# EAGLE board mainboard (EAGLE 9.6.2)
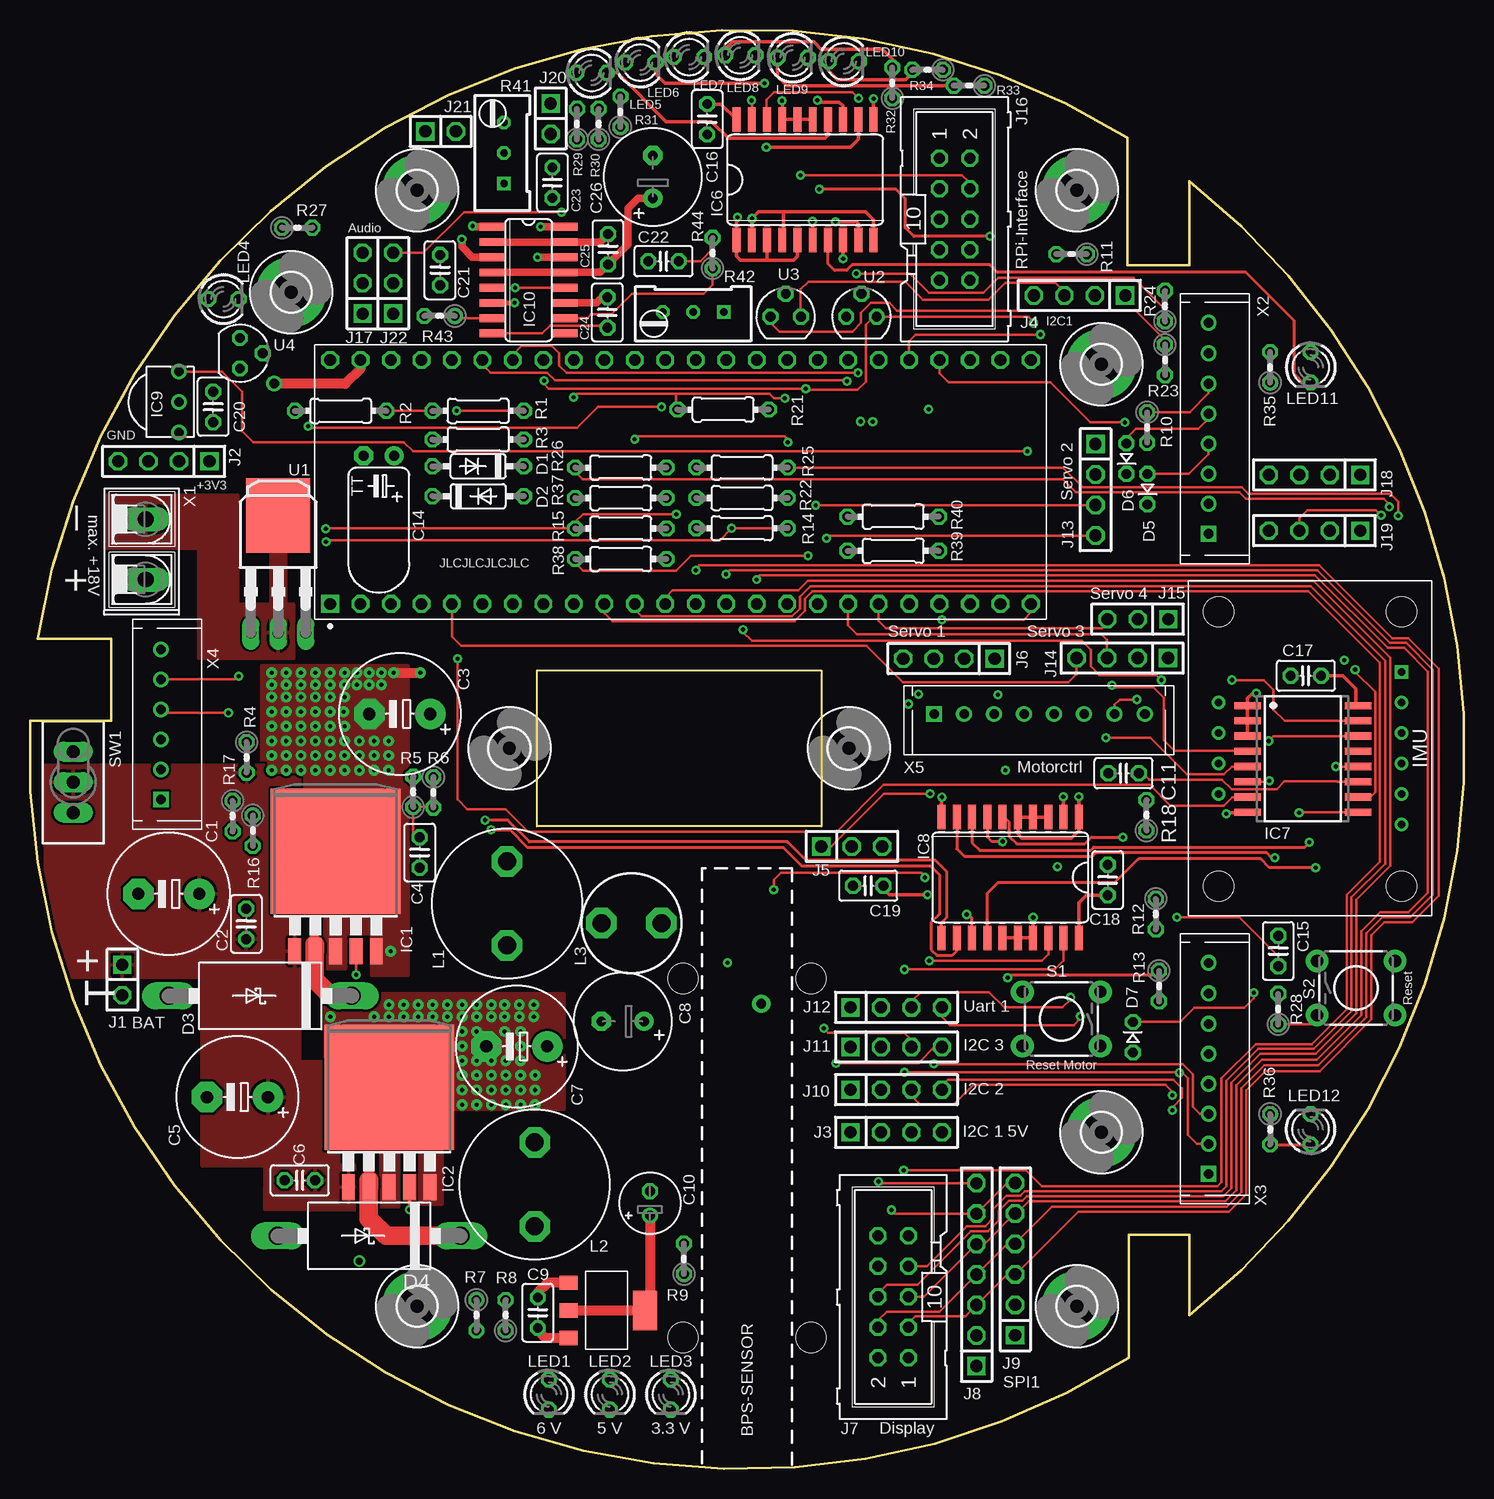
[diagram p2: board, top side]
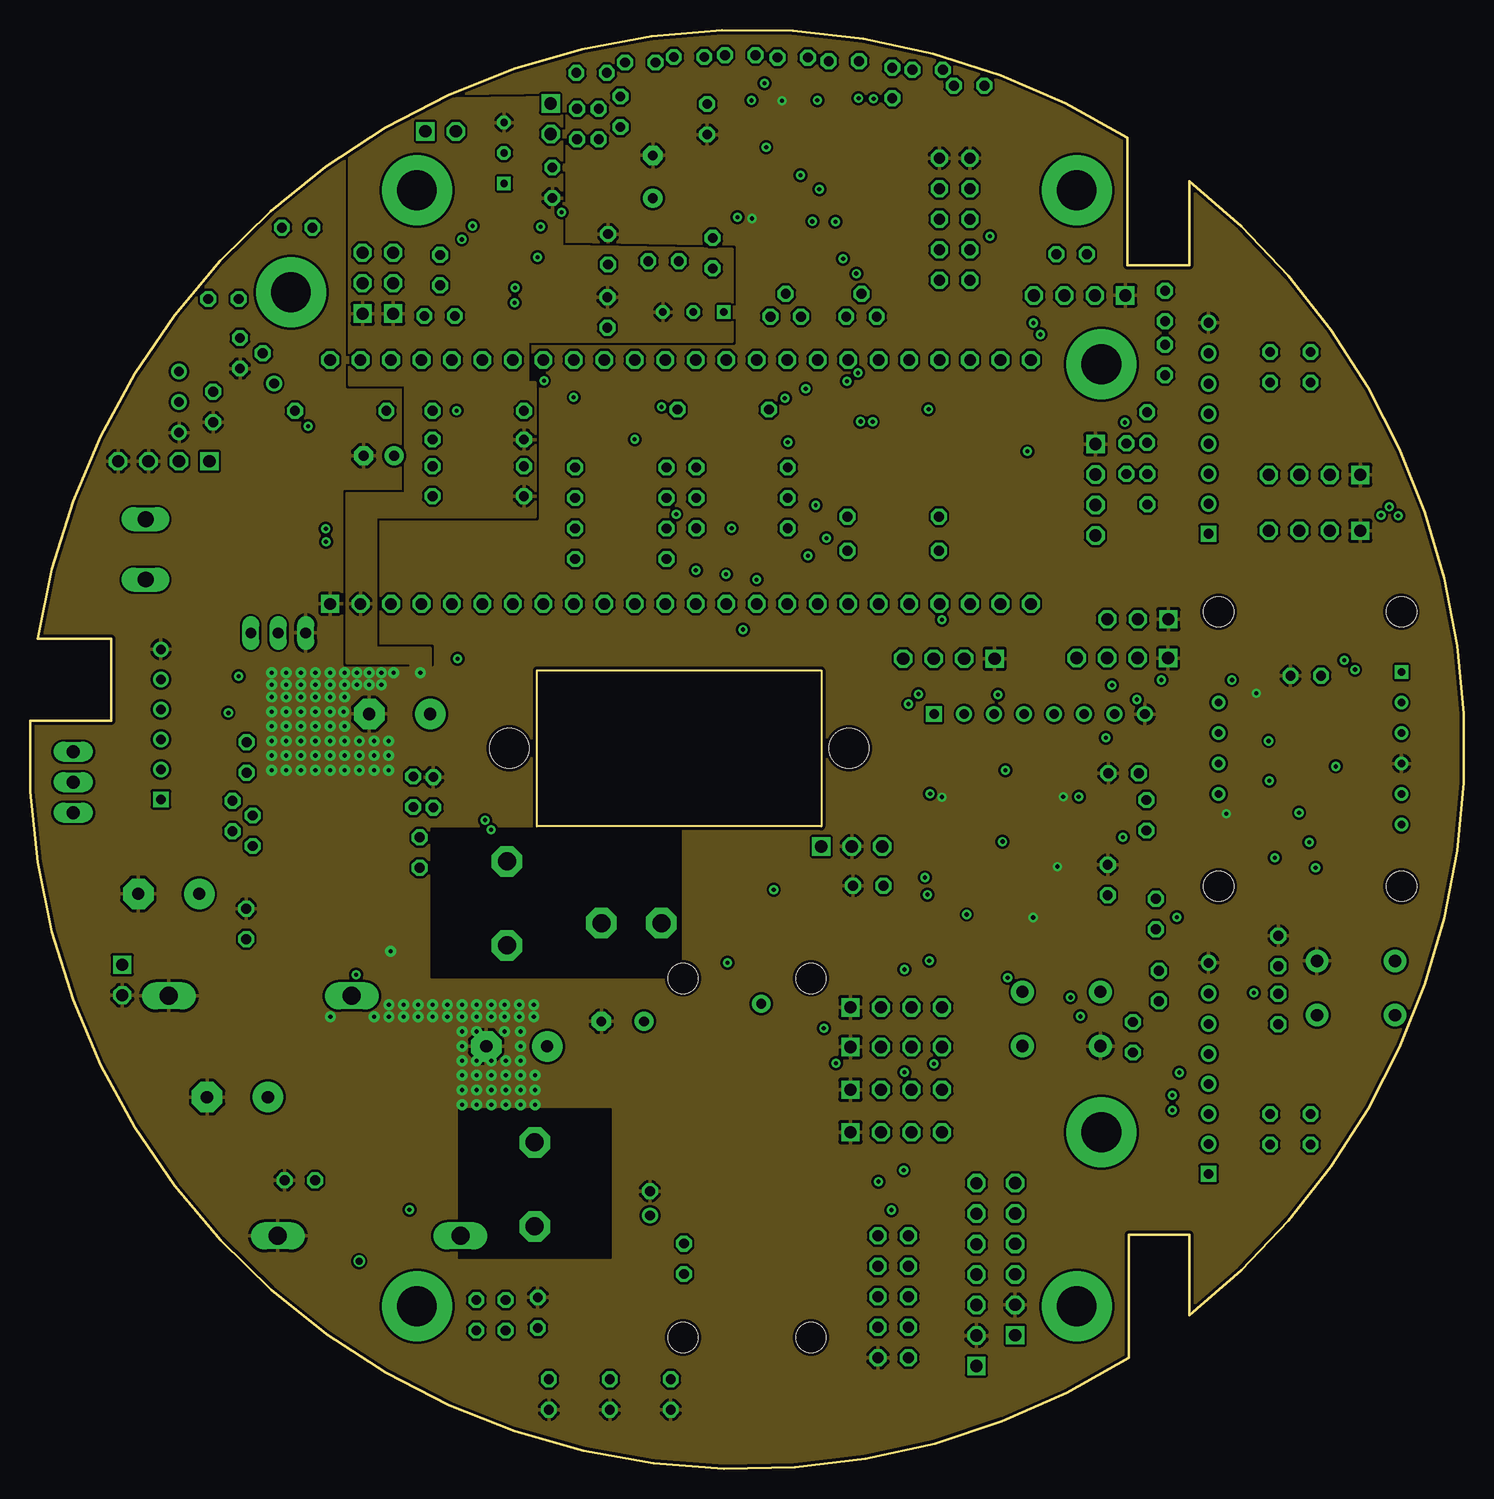
[diagram p3: board, inner layer GND]
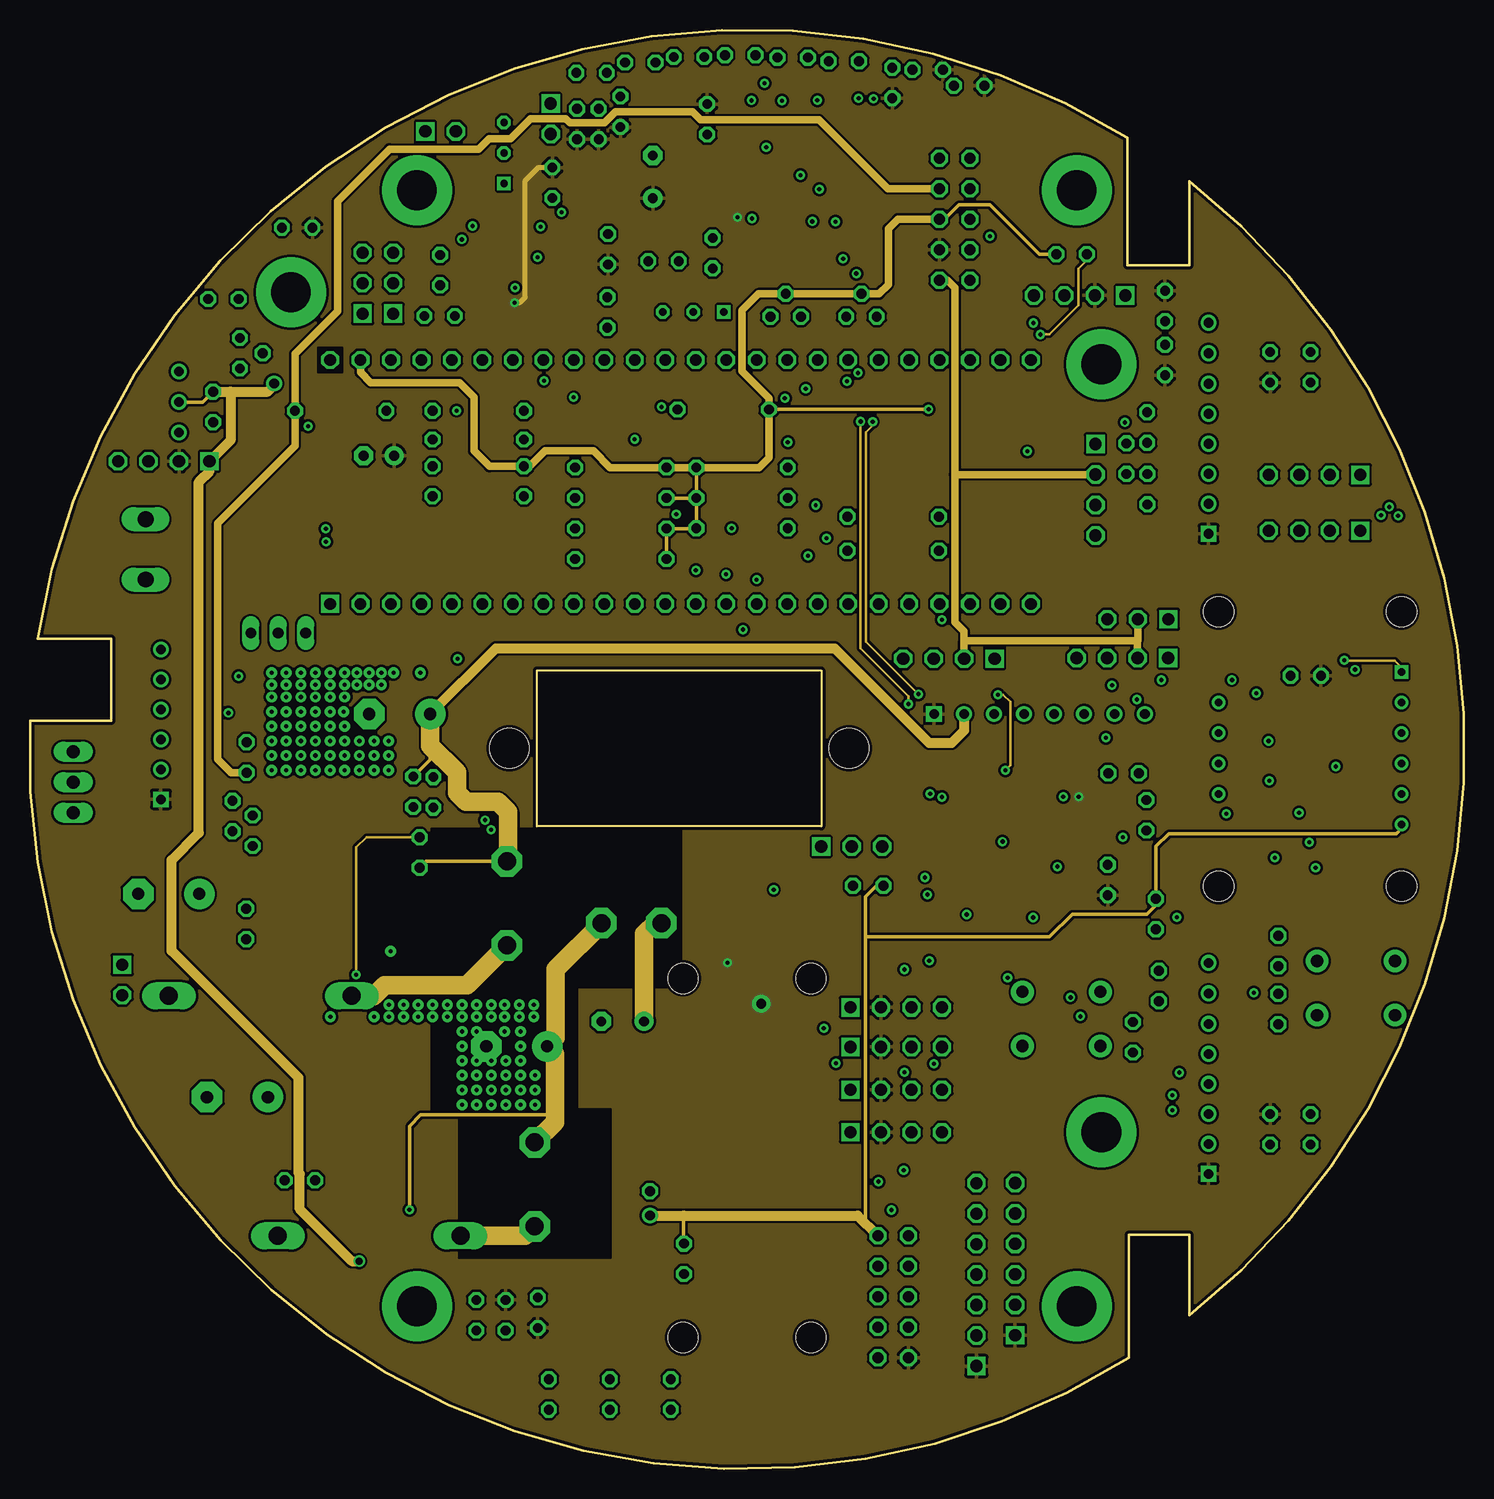
[diagram p4: board, inner layer Route15]
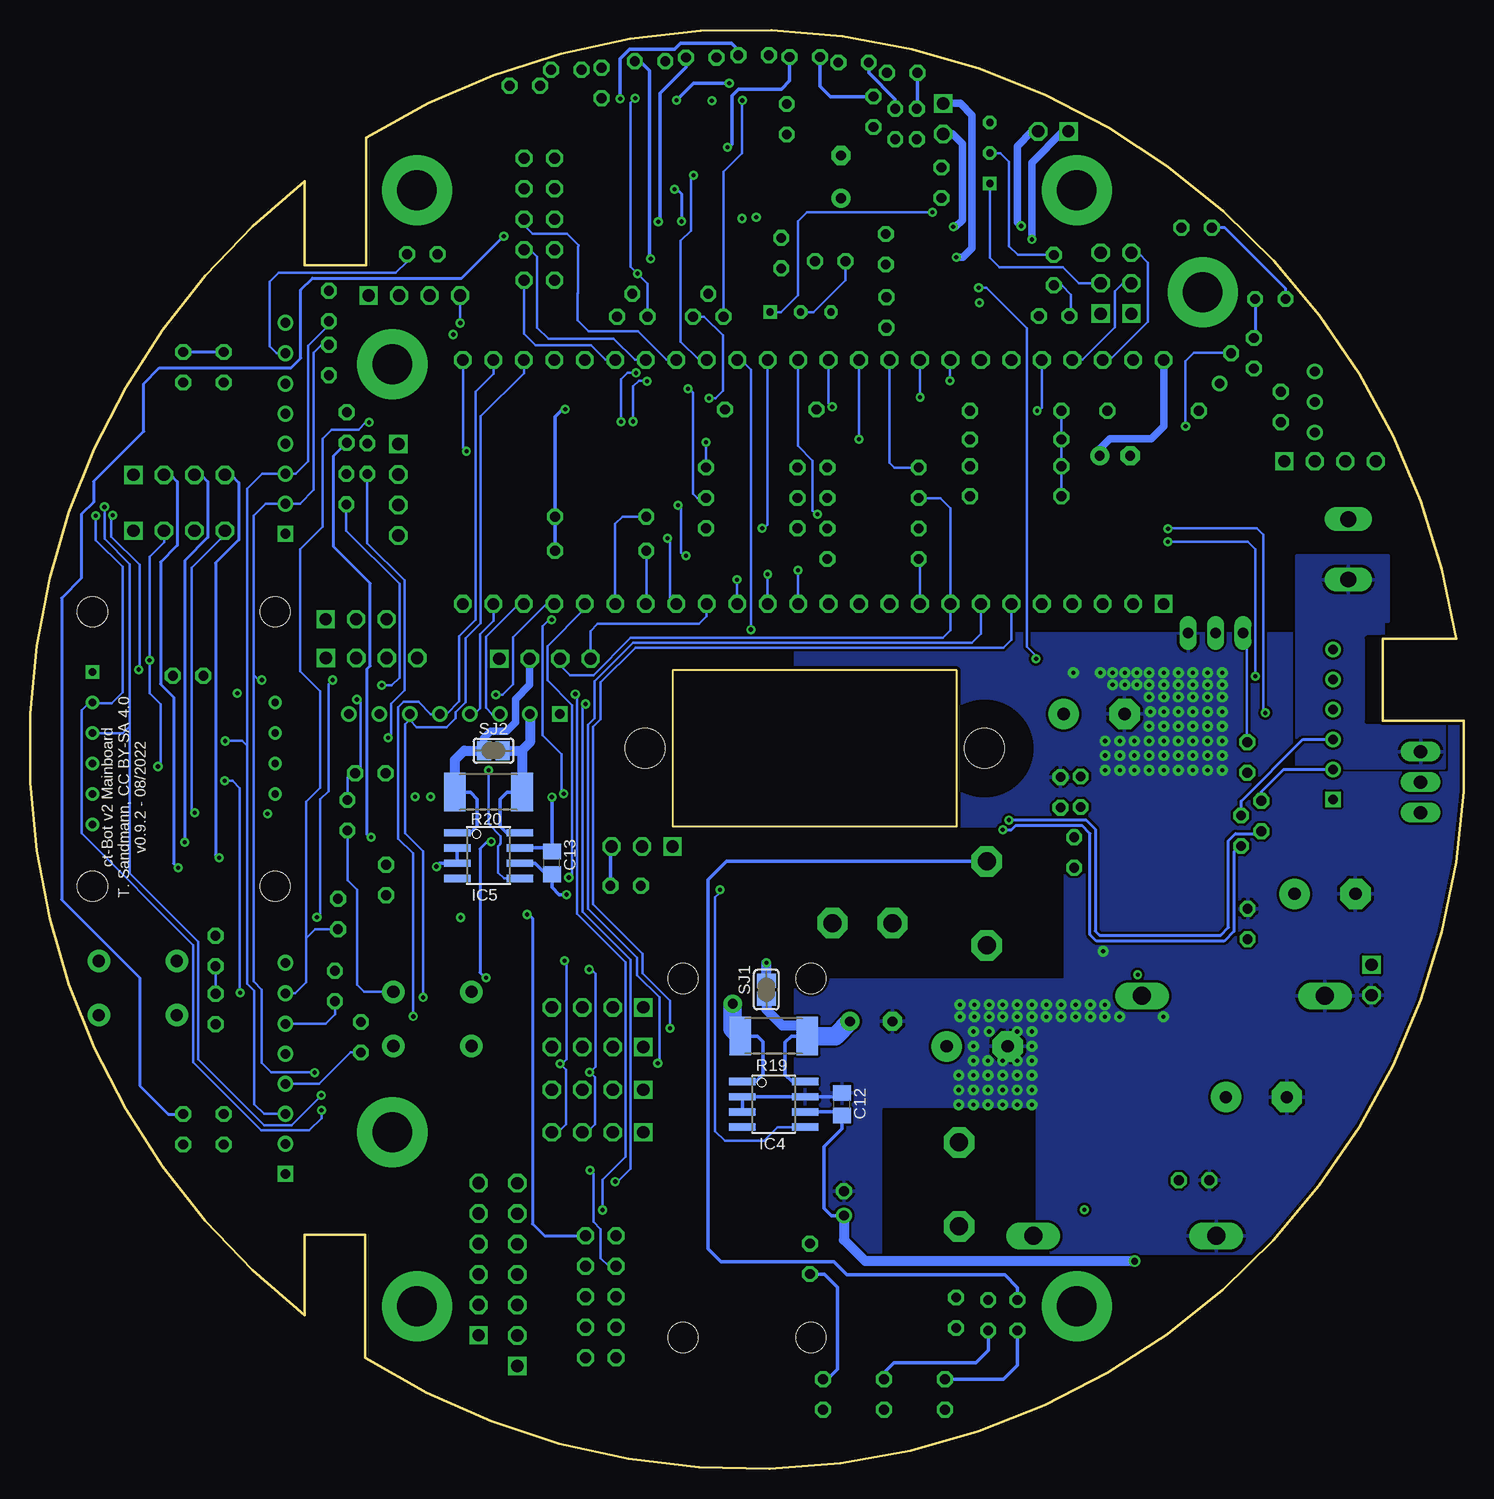
[diagram p5: board, bottom side, seen from below]

Size 119.53 x 119.9 mm. Coordinates in mm from the lower left corner, seen from the top.
Outline: 0.64,69.19 6.77,69.19 6.77,62.33 0,62.33 arc125 91.59,9.27 91.59,19.51 96.65,19.51 96.65,12.8 arc104 96.65,107.29 96.65,100.28 91.49,100.28 91.49,110.92 arc113 0.64,69.19
Outline: 42.27,66.55 65.97,66.55 65.97,53.55 42.27,53.55 42.27,66.55
Copper layers (1+2*15+16): Top 0.035mm / dielectric 0.2mm / GND 0.0175mm / dielectric 1.065mm / Route15 0.0175mm / dielectric 0.2mm / Bottom 0.035mm
Design rules "jlcpcb_4layer_DRU": minimum track width 6mil, minimum drill 0.3mm, track to track 6mil, track to pad 6mil, pad to pad 6mil, via to via 6mil, smd to smd 6mil, copper to edge 10mil, drill to drill 6mil, minimum pad ring 10mil, minimum via ring 8mil, stop-mask expansion 4mil, vias tented up to drill 0mil, thermal gap 10mil
Net classes: 0 default: width 0.203 mm, drill 0.33 mm, clearance 0.203 mm; 1 power: width 0.305 mm, drill 0.33 mm, clearance 0.203 mm to class 0, clearance 0.203 mm; 2 high_current: width 0.305 mm, drill 0.33 mm, clearance 0.203 mm to class 0, clearance 0.203 mm to class 1, clearance 0.203 mm
Holes 2.5 mm at 54.43,10.95 65.1,10.95 65.1,40.87 54.43,40.87
tRestrict: area 42.3,53.5 to 66,66.5; area 91.5,100.3 to 96.6,110.8; area 91.5,9.2 to 96.6,19.5; area 0.1,62.3 to 8.1,69.2
bRestrict: area 42.3,53.5 to 66,66.5; area 0.1,62.3 to 8.1,69.2; area 91.5,100.3 to 96.6,110.8; area 91.5,9.2 to 96.6,19.5
vRestrict: area 42.3,53.5 to 66,66.5; area 0.1,62.3 to 8.1,69.2; area 91.5,100.3 to 96.6,110.8; area 91.5,9.2 to 96.6,19.5

## Footprints (pad centres in the part's own frame; a part is rotated, then mirrored left to right if it is on the bottom)
E5-10,5 = drill 1.016 pad 2.54: + -2.54,0 | drill 1.016 pad 2.54 octagon: - 2.54,0
C025-025X050 = drill 0.813 octagon: 1 -1.27,0; 2 1.27,0
E3,5-8 = drill 0.813 pad 1.6: + -1.778,0 | drill 0.813 pad 1.6 octagon: - 1.778,0
E2-5 = drill 0.813 pad 1.27: + -1.016,0 | drill 0.813 pad 1.27 octagon: - 1.016,0
C0805 = smd 1.3 x 1.5: 1 -0.95,0; 2 0.95,0
TT2D5L = drill 0.813 pad 1.6: + -1.27,0 | drill 0.813 pad 1.6 octagon: - 1.27,0
DO35-7 = drill 0.813 octagon: A 3.81,0; C -3.81,0
DO201T15 = drill 1.499 long: A 7.62,0; C -7.62,0
0207/2V = drill 0.813 octagon: 1 -1.27,0; 2 1.27,0
TO263-5 = smd 1.067 x 2.159: 1 -3.404,-5.791; 2 -1.702,-5.791; 3 0,-5.791; 4 1.702,-5.791; 5 3.404,-5.791 | smd 10.8 x 10.41: 6 0,2.54
LD1117SOT-223 = smd 3.3 x 2: (VOUT) 0,3.2 | smd 1.2 x 1.5: GND -2.3,-3.2; VIN 2.3,-3.2; VOUT 0,-3.2
SO08 = smd 0.61 x 2.21: 1 -1.905,-2.616; 2 -0.635,-2.616; 3 0.635,-2.616; 4 1.905,-2.616; 5 1.905,2.616; 6 0.635,2.616; 7 -0.635,2.616; 8 -1.905,2.616
SO20W = smd 0.66 x 2.032: 1 -5.715,-5.029; 2 -4.445,-5.029; 3 -3.175,-5.029; 4 -1.905,-5.029; 5 -0.635,-5.029; 6 0.635,-5.029; 7 1.905,-5.029; 8 3.175,-5.029; 9 4.445,-5.029; 10 5.715,-5.029; 11 5.715,5.029; 12 4.445,5.029; 13 3.175,5.029; 14 1.905,5.029; 15 0.635,5.029; 16 -0.635,5.029; 17 -1.905,5.029; 18 -3.175,5.029; 19 -4.445,5.029; 20 -5.715,5.029
SO16W = smd 0.6 x 2.2: 1 -4.445,-4.6; 2 -3.175,-4.6; 3 -1.905,-4.6; 4 -0.635,-4.6; 5 0.635,-4.6; 6 1.905,-4.6; 7 3.175,-4.6; 8 4.445,-4.6; 9 4.445,4.6; 10 3.175,4.6; 11 1.905,4.6; 12 0.635,4.6; 13 -0.635,4.6; 14 -1.905,4.6; 15 -3.175,4.6; 16 -4.445,4.6
TSOP324 = drill 0.8: 1 -2.54,0; 2 0,0; 3 2.54,0
SOP-16 = smd 0.66 x 2.032: 1 -4.445,-3.073; 2 -3.175,-3.073; 3 -1.905,-3.073; 4 -0.635,-3.073; 5 0.635,-3.073; 6 1.905,-3.073; 7 3.175,-3.073; 8 4.445,-3.073; 9 4.445,3.073; 10 3.175,3.073; 11 1.905,3.073; 12 0.635,3.073; 13 -0.635,3.073; 14 -1.905,3.073; 15 -3.175,3.073; 16 -4.445,3.073
1X02 = drill 1.016 square: 1 -1.27,0 | drill 1.016 octagon: 2 1.27,0
1X04 = drill 1.016 square: 1 -3.81,0 | drill 1.016 octagon: 2 -1.27,0; 3 1.27,0; 4 3.81,0
1X03 = drill 1.016 square: 1 -2.54,0 | drill 1.016 octagon: 2 0,0; 3 2.54,0
ML10 = drill 0.914 octagon: 1 -5.08,-1.27; 2 -5.08,1.27; 3 -2.54,-1.27; 4 -2.54,1.27; 5 0,-1.27; 6 0,1.27; 7 2.54,-1.27; 8 2.54,1.27; 9 5.08,-1.27; 10 5.08,1.27
1X07 = drill 1.016 square: 1 -7.62,0 | drill 1.016 octagon: 2 -5.08,0; 3 -2.54,0; 4 0,0; 5 2.54,0; 6 5.08,0; 7 7.62,0
1X06 = drill 1.016 square: 1 -6.35,0 | drill 1.016 octagon: 2 -3.81,0; 3 -1.27,0; 4 1.27,0; 5 3.81,0; 6 6.35,0
09HCP = drill 1.5 pad 2.54 octagon: 1 0,3.5; 2 0,-3.5
FASTRON_07HCP_INDUCTOR = drill 1.5 pad 2.54 octagon: 1 -2.5,0; 2 2.5,0
LED3MM = drill 0.813 octagon: A -1.27,0; K 1.27,0
DIP48 = drill 0.965 square: 1 1.27,59.69 | drill 0.965 octagon: 2 1.27,57.15; 3 1.27,54.61; 4 1.27,52.07; 5 1.27,49.53; 6 1.27,46.99; 7 1.27,44.45; 8 1.27,41.91; 9 1.27,39.37; 10 1.27,36.83; 11 1.27,34.29; 12 1.27,31.75; 13 1.27,29.21; 14 1.27,26.67; 15 1.27,24.13; 16 1.27,21.59; 17 1.27,19.05; 18 1.27,16.51; 19 1.27,13.97; 20 1.27,11.43; 21 1.27,8.89; 22 1.27,6.35; 23 1.27,3.81; 24 1.27,1.27; 25 21.59,1.27; 26 21.59,3.81; 27 21.59,6.35; 28 21.59,8.89; 29 21.59,11.43; 30 21.59,13.97; 31 21.59,16.51; 32 21.59,19.05; 33 21.59,21.59; 34 21.59,24.13; 35 21.59,26.67; 36 21.59,29.21; 37 21.59,31.75; 38 21.59,34.29; 39 21.59,36.83; 40 21.59,39.37; 41 21.59,41.91; 42 21.59,44.45; 43 21.59,46.99; 44 21.59,49.53; 45 21.59,52.07; 46 21.59,54.61; 47 21.59,57.15; 48 21.59,59.69
0204/7 = drill 0.813 octagon: 1 -3.81,0; 2 3.81,0
0204V = drill 0.813 octagon: 1 -1.27,0; 2 1.27,0
R2512 = smd 1.8 x 3.2: 1 -2.8,0; 2 2.8,0
RTRIM64W = drill 0.61 square: 1 0.381,-2.54 | drill 0.61 octagon: 2 0.381,0; 3 0.381,2.54
TACTILE_SWITCH_PTH_6.0MM = drill 1.016 pad 1.88: 1 -3.251,2.261; 2 3.251,2.261; 3 -3.251,-2.261; 4 3.251,-2.261
SJ = smd 1.168 x 1.6: 1 -0.762,0; 2 0.762,0
TL3XPO = drill 1.1 pad 1.422 long: 1 -2.54,0; 2 0,0; 3 2.54,0
TO251AA = drill 0.889 long: 1 -2.286,-5.334; 2 0,-5.334; 3 2.286,-5.334 | smd 5.334 x 6.223: 4 0,4.445
SOT54E = drill 0.813 octagon: D -1.27,0; G 0,1.905; S 1.27,0
3,3-PAD = drill 3.3 pad 5.842: B3,3 0,0
3,3 = hole 3.3: 0,0
NXP_9DOF = drill 0.6: 3V3 -3.81,-7.62; AINT1 -1.27,7.62; AINT2 -3.81,7.62; GINT1 3.81,7.62; GINT2 1.27,7.62; GND -1.27,-7.62; SCL 1.27,-7.62; SDA 3.81,-7.62; VIN -6.35,-7.62 | drill 0.6 square: RST 6.35,-7.62 | hole 2.5: -11.49,-7.62; 11.37,-7.62; -11.49,7.62; 11.37,7.62
AK500/2-H = drill 1.321 long: 1 -2.515,0; 2 2.515,0
B8B-XH = drill 0.8 square: P$1 8.79,0 | drill 0.8: P$2 6.29,0; P$3 3.79,0; P$4 1.29,0; P$5 -1.21,0; P$6 -3.71,0; P$7 -6.25,0; P$8 -8.79,0
B6B-XH = drill 0.8 square: P$1 6.25,0 | drill 0.8: P$2 3.75,0; P$3 1.25,0; P$4 -1.25,0; P$5 -3.75,0; P$6 -6.25,0

## Placement (x,y rotation side)
C1  680uF  [E5-10,5]  11.57,47.92 180 top
C2  22uF  [C025-025X050]  18.03,45.41 90 top
C3  220uF  [E5-10,5]  30.82,62.9 180 top
C4  1nF  [C025-025X050]  32.49,51.36 90 top
C5  680uF  [E5-10,5]  17.3,30.98 180 top
C6  22uF  [C025-025X050]  22.49,24.04 180 top
C7  220uF  [E5-10,5]  40.58,35.21 180 top
C8  180uF  [E3,5-8]  49.4,37.29 180 top
C9  100nF  [C025-025X050]  42.33,13.01 90 top
C10  10uF  [E2-5]  51.68,22.12 90 top
C11  1nF  [C025-025X050]  91.16,57.97 180 top
C12  100nF  [C0805]  51.84,30.38 90 bottom
C13  100nF  [C0805]  76.02,50.5 90 bottom
C14  10uF  [TT2D5L]  29.08,84.43 180 top
C15  1nF  [C025-025X050]  104.06,43.15 90 top
C16  100nF  [C025-025X050]  56.45,112.46 270 top
C17  100nF  [C025-025X050]  106.35,66.09 180 top
C18  100nF  [C025-025X050]  89.84,49.07 90 top
C19  100nF  [C025-025X050]  69.88,48.59 180 top
C20  100nF  [C025-025X050]  15.27,88.49 270 top
C21  470nF  [C025-025X050]  34.18,99.89 90 top
C22  470nF  [C025-025X050]  52.81,100.64 180 top
C23  1uF  [C025-025X050]  43.55,107.17 270 top
C24  100nF  [C025-025X050]  48.13,96.37 90 top
C25  1uF  [C025-025X050]  48.19,101.63 90 top
C26  470uF  [E3,5-8]  51.92,107.67 90 top
D1  BAT42  [DO35-7]  37.36,83.54 180 top
D2  BAT42  [DO35-7]  37.36,81.05 0 top
D3  SB 540  [DO201T15]  19.2,39.41 180 top
D4  SB 540  [DO201T15]  28.27,19.41 180 top
D5  BAT42  [0207/2V]  93.15,81.64 270 top
D6  BAT42  [0207/2V]  91.41,84.18 270 top
D7  BAT42  [0207/2V]  91.95,35.97 90 top
IC1  LM2596S-ADJ  [TO263-5]  25.48,48.93 0 top
IC2  LM2596S-5.0  [TO263-5]  29.95,29.25 0 top
IC3  LD1117A  [LD1117SOT-223]  48.08,13.21 270 top
IC4  [SO08]  57.53,30.38 270 bottom
IC5  [SO08]  81.31,51.11 270 bottom
IC6  PCA9634  [SO20W]  64.61,107.43 0 top
IC7  PCA9554  [SO16W]  106.09,59.16 270 top
IC8  PCA9634  [SO20W]  81.71,49.28 180 top
IC9  TSOP324  [TSOP324]  12.42,88.9 270 top
IC10  PAM8403  [SOP-16]  41.57,99.06 270 top
J1  Bat_In  [1X02]  7.7,40.74 270 top
J2  Erw_Pwr  [1X04]  11.15,83.96 180 top
J3  I2C1_5V  [1X04]  72.21,28.04 0 top
J4  I2C_1  [1X04]  87.49,97.78 180 top
J5  BPS  [1X03]  68.5,51.87 0 top
J6  Servo_1  [1X04]  76.6,67.51 180 top
J7  SPI_1  [ML10]  71.96,14.33 90 top
J8  SPI_1  [1X07]  78.9,16.19 90 top
J9  SPI_1  [1X06]  82.12,17.48 90 top
J10  I2C_2  [1X04]  72.21,31.6 0 top
J11  I2C_3  [1X04]  72.21,35.15 0 top
J12  Uart_1  [1X04]  72.21,38.46 0 top
J13  Servo_2  [1X04]  88.82,81.59 270 top
J14  Servo_3  [1X04]  91.06,67.56 180 top
J15  Servo_4  [1X03]  92.35,70.81 180 top
J16  RPi_Interface  [ML10]  77.07,104.14 270 top
J17  Audio  [1X03]  27.72,98.81 90 top
J18  Erw_DRV  [1X04]  107.09,82.83 180 top
J19  Erw_ENA  [1X04]  107.09,78.18 180 top
J20  SPEAKER_R  [1X02]  43.41,112.51 270 top
J21  SPEAKER_L  [1X02]  34.22,111.46 0 top
J22  AUDIO_IN  [1X03]  30.28,98.81 90 top
L1  47u  [09HCP]  39.76,47.12 180 top
L2  47u  [09HCP]  42.08,23.7 180 top
L3  3u3  [FASTRON_07HCP_INDUCTOR]  50.13,45.48 0 top
LED1  6V  [LED3MM]  43.26,6.2 270 top
LED2  5V  [LED3MM]  48.34,6.2 270 top
LED3  3.3V  [LED3MM]  53.42,6.2 270 top
LED4  rot  [LED3MM]  16.13,97.49 0 top
LED5  weiss  [LED3MM]  46.81,116.33 0 top
LED6  blau  [LED3MM]  50.88,117.2 0 top
LED7  gruen  [LED3MM]  54.94,117.65 0 top
LED8  gelb  [LED3MM]  59.21,117.81 0 top
LED9  orange  [LED3MM]  63.58,117.6 0 top
LED10  rot  [LED3MM]  67.84,117.3 0 top
LED11  blau  [LED3MM]  106.76,91.8 270 top
LED12  blau  [LED3MM]  106.76,28.3 90 top
MCU  CTBOT_MCU_BRD_V2  [DIP48]  84.71,70.82 90 top
R1  1k  [0204/7]  37.36,88.16 180 top
R2  100k  [0204/7]  25.9,88.17 180 top
R3  22k  [0204/7]  37.36,85.78 180 top
R4  100k  [0204V]  18.06,59.28 270 top
R5  3k9 0.1%  [0204V]  31.95,56.42 90 top
R6  1k 0.1%  [0204V]  33.62,56.37 270 top
R7  27k  [0204V]  37.21,12.8 270 top
R8  22k  [0204V]  39.65,12.8 90 top
R9  15k  [0204V]  54.51,17.5 90 top
R10  180  [0204V]  93.12,86.78 270 top
R11  47k  [0204V]  86.83,101.22 180 top
R12  47k  [0204V]  93.85,46.23 270 top
R13  180  [0204V]  94.11,40.23 270 top
R14  47k  [0204/7]  59.36,78.39 180 top
R15  47k  [0204/7]  49.25,78.36 0 top
R16  180  [0204V]  18.57,53.18 270 top
R17  180  [0204V]  16.88,54.4 270 top
R18  330  [0204V]  93.07,54.47 90 top
R19  30m  [R2512]  57.53,36.07 180 bottom
R20  100m  [R2512]  81.31,56.39 180 bottom
R21  4k7  [0204/7]  57.79,88.27 0 top
R22  4k7  [0204/7]  59.36,80.9 180 top
R23  10k  [0204V]  94.61,92.41 270 top
R24  10k  [0204V]  94.61,96.9 90 top
R25  1k1  [0204/7]  59.36,83.44 180 top
R26  1k1  [0204/7]  49.25,83.44 0 top
R27  1k8  [0204V]  22.28,103.43 0 top
R28  330  [0204V]  104.05,38.32 90 top
R29  27k  [0204V]  45.6,112.07 90 top
R30  10k  [0204V]  47.41,112.07 90 top
R31  15k  [0204V]  49.21,113.09 90 top
R32  2k2  [0204V]  71.88,115.49 90 top
R33  2k2  [0204V]  78.28,115.27 180 top
R34  1k8  [0204V]  74.83,116.59 180 top
R35  10k  [0204V]  103.38,91.8 90 top
R36  10k  [0204V]  103.38,28.3 270 top
R37  4k7  [0204/7]  49.25,80.9 0 top
R38  4k7  [0204/7]  49.25,75.82 0 top
R39  4k7  [0204/7]  71.96,76.51 0 top
R40  4k7  [0204/7]  71.96,79.35 0 top
R41  5k  [RTRIM64W]  39.13,109.65 0 top
R42  5k  [RTRIM64W]  55.3,96.01 90 top
R43  10k  [0204V]  34.15,96.07 180 top
R44  10k  [0204V]  56.91,101.31 90 top
S1  Reset  [TACTILE_SWITCH_PTH_6.0MM]  85.98,37.49 180 top
S2  Reset  [TACTILE_SWITCH_PTH_6.0MM]  110.54,40.07 0 top
SJ1  [SJ]  58.14,39.93 90 bottom
SJ2  [SJ]  80.9,59.84 180 bottom
SW1  TL32PO  [TL3XPO]  3.6,57.23 270 top
U1  IRLU024N  [TO251AA]  20.69,74.99 0 top
U2  BS108  [SOT54E]  69.32,96.01 0 top
U3  BS108  [SOT54E]  62.99,96.01 0 top
U4  BS108  [SOT54E]  17.5,92.96 270 top
U$1  [3,3-PAD]  32.27,106.55 0 top
U$2  [3,3-PAD]  87.27,106.55 0 top
U$3  [3,3-PAD]  21.77,98.05 0 top
U$4  [3,3-PAD]  89.32,92.05 0 top
U$5  [3,3-PAD]  89.32,28.05 0 top
U$6  [3,3-PAD]  32.27,13.55 0 top
U$7  [3,3-PAD]  87.27,13.55 0 top
U$8  [3,3]  39.97,60.05 0 top
U$9  [3,3]  68.27,60.05 0 top
U$10  IMU  [NXP_9DOF]  106.71,60.05 90 top
X1  max. 18V  [AK500/2-H]  9.63,76.62 270 top
X2  Sensoren L  [B8B-XH]  98.25,86.72 270 top
X3  Sensoren R  [B8B-XH]  98.25,33.38 270 top
X4  Liniensensoren  [B6B-XH]  10.91,62.04 270 top
X5  Motorctrl  [B8B-XH]  84.15,62.89 180 top

## Tracks (layer width: path | path; a pad name or v marks a point on that pad's centre or on a via)
5V_SUPPLY
  Route15 1.524: C8.+ 51.18,44.57 52.09,45.48 L3.2
  Bottom 0.305: IC4.8 56.02,32.28 56.59,32.85 56.59,35.55 56.07,36.07 R19.1
  Bottom 0.813: SJ1.1 58.14,38.26 56.83,36.95 54.63,36.95 54.63,36.17 R19.1
  Bottom 1.524: C8.+ 52.4,36.07 R19.1
6V_SERVO
  Route15 0.61: 77.86,68.99 77.86,69.79 77.09,70.56 77.09,82.86 | 92.33,68.99 77.86,68.99 | J16.9 76.47,99.06 77.09,98.44 77.09,82.86 | J15.2 92.35,69.01 92.33,68.99 | J14.2 92.33,68.99 | J6.2 77.86,67.53 77.86,68.99 | J13.2 77.09,82.86
  Bottom 0.305: IC5.1 82.8,53.01 82.24,53.57 82.24,55.81 82.82,56.39 R20.2
  Bottom 0.61: J6.2 77.87,65.34 79.07,64.14 79.07,62.21 79.82,61.47 81.14,61.47 81.71,60.89 81.71,59.89 SJ2.2
  Bottom 0.813: R20.2 84.11,59.08 83.34,59.84 SJ2.2
+3V3  (via drill 0.35, 0.55, 0.8 pad 1.3)
  Top 0.305: v74.8,47.85 71.64,47.85 71.15,48.34 C19.1
  Top 0.813: MCU.47 27.56,91.69 26.28,90.41 20.38,90.41 v20.35,90.44 | IC3.VOUT IC3.(VOUT) 51.68,13.61 C10.+
  Route15 0.305: R25.2 R22.2 | R22.2 R14.2 55.52,78.36 R15.2 R38.2 | R37.2 R22.2 | IC9.2 14.4,88.9 C20.1 | v74.91,88.29 61.61,88.29 R21.2 | J7.10 70.69,19.48 69.65,20.52 69.65,44.4 | R9.2 54.48,18.8 54.48,21.11 | U$10.VIN 114.33,53.38 113.89,52.94 94.93,52.94 93.85,51.86 R12.1 93.85,46.96 93.12,46.23 86.9,46.23 85,44.33 69.72,44.33 69.65,44.4 | J16.5 76.22,104.14 77.44,105.36 80.03,105.36 84.17,101.22 R11.2 | C19.1 70.54,48.59 69.65,47.69 69.65,44.4
  Route15 0.61: MCU.47 27.56,91.38 28.41,90.53 35.8,90.53 37.01,89.32 37.01,84.84 38.3,83.54 D1.C 41.63,83.54 42.93,84.84 46.96,84.84 48.36,83.44 R26.2 R25.2 60.78,83.44 61.6,84.26 R21.2 61.6,89.21 59.33,91.47 59.33,96.53 60.72,97.92 U3.G U2.G 70.78,97.92 71.55,98.69 71.55,103.35 72.34,104.14 J16.5
  Route15 0.813: v27.44,17.3 26.83,17.3 22.49,21.64 22.49,24.57 22.38,24.68 22.38,32.6 11.81,43.16 11.81,50.73 14.07,52.99 14.07,82.25 14.96,83.15 J2.1 16.71,85.71 16.71,89.76 C20.1 19.82,89.76 20.35,90.29 v20.35,90.44 | J7.10 68.99,21.11 54.48,21.11 C10.+
  Bottom 0.305: R39.2 R40.2 75.77,87.67 75.15,88.29 v74.91,88.29 | 44.93,17.3 44.95,17.32 | J5.3 71.15,51.77 C19.1 | IC4.6 52.16,29.74 C12.1 51.84,28.35 53.33,26.86 53.33,21.71 52.73,21.11 C10.+ | IC5.6 77.42,50.47 76.5,49.55 C13.1 76.02,48.47 75.4,47.85 v74.8,47.85
  Bottom 0.813: C10.+ 51.68,19.09 49.91,17.32 44.95,17.32 | v27.44,17.3 44.93,17.3
+5V  (via drill 0.35, 0.8 pad 1.52)
  Top 0.305: IC6.20 57.62,113.73 C16.1 | v58.98,104.29 58.9,104.2 IC6.1 58.9,101.06 59.24,100.72 61.43,100.72 | 61.43,100.72 63.66,100.72 63.98,101.04 IC6.5 | IC6.3 61.44,100.73 61.43,100.72 | C17.1 109.45,66.09 110.52,65.01 110.52,63.77 IC7.16 | IC8.3 IC8.4 IC8.5 82.35,52.91 82.7,52.56 86.82,52.56 87.43,53.16 IC8.1 v87.43,56 v87.42,56.01 | IC8.20 87.43,47.17 88.08,47.82 89.82,47.82 C18.1
  Top 0.406: IC10.6 v40.38,97.16 v40.39,97.17
  Top 0.61: C26.+ 50.7,105.89 49.86,105.05 49.86,102.03 C25.1 47.52,99.7 IC10.13 IC10.4
  Top 0.813: C9.1 42.33,11.53 42.95,10.91 IC3.VIN
  Route15 0.406: v40.39,97.17 40.81,97.17 41.29,97.65 41.29,107.35 42.39,108.45 43.54,108.45 C23.1
  Bottom 0.305: IC4.1 59.01,32.28 58.43,32.87 58.43,35.6 58.89,36.07 R19.2
  Bottom 0.61: C14.+ 30.35,85 29.5,85.85 26.04,85.85 25.02,86.87 MCU.48
  Bottom 0.813: SJ1.2 v58.14,42.17
  Bottom 1.524: R19.2 60.95,36.69 v60.95,38.76
  pour Route15 (rank 5): -1.19,121.01 120.73,121.01 120.73,-0.91 -1.19,-0.91
+6V
  Route15 0.305: C4.1 33.02,50.62 L1.2 | R5.2 33.36,59.11 33.36,60.25 C3.+
  Route15 0.813: C3.+ 38.84,68.38 67.07,68.38 74.94,60.51 76.85,60.51 77.86,61.52 X5.P$2
  Route15 1.524: L1.2 39.76,50.64 39.84,50.71 39.84,54.75 39.01,55.58 36.34,55.58 35.59,56.33 35.59,58.03 33.36,60.25 C3.+
  Bottom 0.305: R7.1 37.21,15.11 38.26,16.16 51.44,16.16 52.53,17.25 61.94,17.25 63.02,18.33 63.02,49.07 61.47,50.62 L1.2 | IC5.8 79.79,53.01 80.34,53.56 80.34,55.81 79.77,56.39 R20.1
  Bottom 0.813: X5.P$2 77.86,60.55 78.51,59.9 78.51,59.84 | 78.51,59.84 R20.1 | SJ2.1 78.51,59.84
ABST_SHDN_L  (via drill 0.35)
  Top 0.203: IC7.4 101.43,59.85 95.38,59.85 94.51,60.72 94.51,64.25 93.64,65.13 90.37,65.13 v90.2,65.3
  Bottom 0.203: v90.2,65.3 89.37,65.3 88.72,65.94 88.72,73.76 93.15,78.19 D5.2
ABST_SHDN_R  (via drill 0.35)
  Top 0.203: IC7.6 103.21,57.25 v103.31,57.35 | v102.02,39.67 102.02,39.2 101.23,38.4 97.08,38.4 95.91,37.24 D7.2
  Bottom 0.203: v103.31,57.35 102.65,57.35 102.03,56.73 102.03,39.93 102.02,39.92 v102.02,39.67
AGND
  Top 0.61: IC10.11 47.21,97.16 47.69,97.64 C24.2
  pour GND: 26.64,114.07 44.32,114.31 44.32,101.89 58.51,101.62 58.51,93.98 41.48,93.98 41.48,90.32 26.64,90.32
  pour GND: 31.32,90.53 42.09,90.53 42.09,79.35 31.32,79.35
  pour GND: 26.44,81.28 26.44,67.16 33.35,67.16 33.35,68.38 28.82,68.38 28.82,79.35 31.52,79.35 31.52,81.27
AUDIO_L
  Bottom 0.203: J17.2 28.41,98.81 29.07,98.14 29.07,95.11 31.78,92.41 MCU.45
AUDIO_R
  Bottom 0.203: J17.3 27.15,101.35 26.33,100.52 26.33,95.58 29.51,92.41 MCU.46
BAT+
  pour Bottom (rank 2): 13.94,76.1 13.94,58.42 1.65,58.42 1.65,62.69 6.73,62.69 6.73,70.61 6.3,70.61 6.3,76.1
BAT-
  pour Top: 6.32,81.13 17.3,81.13 17.3,72.04 21.98,72.04 21.98,67.56 14.05,67.56 14.05,76.71 6.32,76.71
  pour Top (no thermals): 20.1,77.52 21.32,77.52 21.32,68.7 20.1,68.7
BAT_IN
  Route15 0.61: R4.2 16.77,58.01 15.65,59.13 15.65,78.81 22.09,85.25 R2.2 22.09,92.91 25.63,96.45 25.63,105.63 29.97,109.97 37.4,109.97 38.28,110.85 40.06,110.85 41.72,112.51 44.66,112.51 45.01,112.17 47.9,112.17 48.81,113.08 55.25,113.08 55.91,112.41 65.79,112.41 71.51,106.68 J16.3
  pour Top (rank 2): 22.49,58.68 22.49,33.94 25.73,33.94 25.73,25.27 14.35,25.27 14.35,40.97 1.25,40.97 1.25,58.63
  pour Top: 19.6,25.37 27.06,25.31 27.02,21.57 19.57,21.63
  pour Top: 14.86,45.76 22.49,45.76 22.49,41.56 14.86,41.56
BAT_IN_FB  (via drill 0.33)
  Top 0.203: v35.57,88.18 41.15,88.18 R1.1
  Bottom 0.203: v35.57,88.18 35.43,88.18 35.18,88.44 MCU.44
BPS  (via drill 0.35)
  Top 0.203: v76.03,70.77 82.83,70.77 83.44,71.37 MCU.24 | J5.1 66.8,51.87 71.17,56.24 v75.04,56.24 v75.04,56.25
  Bottom 0.203: v76.03,70.77 76.24,70.77 76.8,70.2 76.8,61.12 75.23,59.55 75.23,56.44 v75.04,56.25
CURRENT_5V  (via drill 0.35)
  Top 0.203: v62,48.26 62,49.07 62.61,49.68 74.31,49.68 74.61,49.38 v74.61,49.28
  Bottom 0.203: IC4.5 57.2,28.47 58.34,27.33 61.6,27.33 62.41,28.14 62.41,47.61 62,48.02 v62,48.26 | v74.61,49.28 74.34,49.55 74.34,63.65 76.4,65.71 76.4,68.54 73.28,71.66 MCU.20
CURRENT_SERVO  (via drill 0.35)
  Route15 0.203: v81.31,58.22 81.71,58.62 81.71,63.9 81.1,64.52 v80.7,64.52
  Bottom 0.203: IC5.5 80.01,49.2 80.49,49.68 80.49,51.89 80.39,51.99 80.39,52.02 80.29,52.12 80.29,52.73 81.31,53.75 v81.31,58.22 | v80.7,64.52 80.14,64.52 79.27,65.38 79.27,69.28 76.47,72.09 MCU.21
DEBUG_LED  (via drill 0.35)
  Top 0.203: v52.65,88.49 47.37,88.49 45.62,86.74 23.35,86.74 v23.2,86.89
  Bottom 0.203: v23.2,86.89 23.2,92.28 22.49,92.99 19.43,92.99 U4.G | MCU.37 52.96,88.8 v52.65,88.49
DRV_DISPLAY  (via drill 0.35)
  Top 0.254: IC8.13 78.54,45.9 78.25,46.2 v78.08,46.2
  Bottom 0.254: v78.08,46.2 77.98,46.2 77.65,45.87 77.65,20.42 76.63,19.41 J7.9
DRV_ERW_1  (via drill 0.35)
  Top 0.254: IC8.9 77.27,51.67 77.91,51.03 88.55,51.03 88.85,51.34 103.08,51.34 103.49,50.93 v103.76,50.93
  Bottom 0.254: v103.76,50.93 103.84,50.93 104.06,51.16 104.06,75.49 102.13,77.42 102.13,82.18 102.77,82.83 J18.4
DRV_ERW_2  (via drill 0.35)
  Top 0.254: IC8.8 78.54,52.19 79.18,51.55 88.42,51.55 88.68,51.81 106.28,51.81 106.64,52.17 v106.64,52.21
  Bottom 0.254: v106.64,52.21 106.63,52.22 106.63,75.7 104.7,77.62 104.7,82.27 105.26,82.83 J18.3
DRV_ERW_3  (via drill 0.35)
  Top 0.254: IC8.14 79.81,47.96 80.72,48.87 90.45,48.87 92.41,50.83 102.59,50.83 103.32,50.1 v107.17,50.1
  Bottom 0.254: v107.17,50.1 107.19,50.12 107.24,50.12 107.57,50.44 107.57,64.31 108.65,65.39 108.65,75.55 107.24,76.97 107.24,82.26 107.81,82.83 J18.2
DRV_KANTLED_L  (via drill 0.35)
  Top 0.254: IC8.6 81.23,54.31 81.62,53.92 81.62,52.73 82.27,52.08 87.92,52.08 88.48,52.64 v91.1,52.64
  Bottom 0.254: R10.2 94.22,84.41 94.22,76.85 91.17,73.8 91.17,66.92 91.41,66.69 91.41,52.83 91.22,52.64 v91.1,52.64
DRV_KANTLED_R  (via drill 0.35)
  Top 0.254: IC8.7 79.81,52.66 80.19,52.27 v81.08,52.27 | v81.5,40.91 v81.51,40.91 81.72,41.12 93.92,41.12 94.11,41.31 R13.1
  Bottom 0.254: v81.08,52.27 81.41,52.27 82.02,51.66 82.02,41.36 81.57,40.91 v81.5,40.91
DRV_LINE_L  (via drill 0.35)
  Top 0.254: v37.93,54.07 39.83,54.07 41.64,52.25 63.14,52.25 64.68,50.71 75.48,50.71 76.39,49.8 76.39,45.91 76,45.52 IC8.11
  Bottom 0.254: v37.93,54.07 37.91,54.08 31.49,54.08 30.72,53.3 30.72,44.81 30.38,44.48 20.27,44.48 19.63,45.11 19.63,52.35 19.04,52.93 17.07,52.93 R17.2
DRV_LINE_R  (via drill 0.35)
  Top 0.254: v38.44,53.25 v38.45,53.24 40.01,53.24 41.45,51.8 62.78,51.8 64.33,50.24 75.08,50.24 75.82,49.5 75.82,46.23 75.12,45.53 75.12,43.28 75.6,42.79 76.88,42.79 77.27,43.17 IC8.12
  Bottom 0.254: R16.2 18.68,51.91 19.17,51.41 19.17,44.78 19.97,43.98 30.63,43.98 31.17,44.52 31.17,52.94 31.86,53.62 37.34,53.62 37.72,53.25 v38.44,53.25
ENA_AUDIO  (via drill 0.35)
  Top 0.203: v40.45,98.42 IC10.12 | IC7.7 100.21,55.98 99.5,55.27 95.06,55.27 93.33,57 71.15,57 67.26,53.11 41.51,53.11 39.65,54.97 36.44,54.97 35.63,55.78 35.63,67.5 35.64,67.51 v35.66,67.51
  Bottom 0.203: v35.66,67.51 35.66,67.75 36.42,68.51 36.42,95.06 39.78,98.42 v40.45,98.42
ENA_ERW_1  (via drill 0.35)
  Top 0.203: IC7.9 105.83,54.71 v105.79,54.67
  Bottom 0.203: v105.79,54.67 106.06,54.94 106.06,75.09 103.28,77.87 J19.4
ENA_ERW_2  (via drill 0.35)
  Top 0.203: v110.46,66.61 110.46,66.42 112.14,64.75 112.14,56.37 111.74,55.98 IC7.10 | v112.62,79.47 112.2,79.89 106.5,79.89 105.82,79.21 J19.3
  Bottom 0.203: v112.62,79.47 112.74,79.36 112.74,77.69 110.4,75.36 110.4,66.66 v110.46,66.61
FERNBED  (via drill 0.33)
  Top 0.203: v83.15,84.79 v83.14,84.78 31.94,84.78 31.15,85.57 18.6,85.57 17.7,86.46 17.7,89.76 16.03,91.44 IC9.1
  Bottom 0.203: v83.15,84.79 83.44,85.08 MCU.25
GND  (via drill 0.35, 0.35 pad 0.9)
  Top 0.305: 62.81,104.74 69.66,104.74 70.33,104.08 IC6.10 | 62.81,104.74 62.81,102.5 IC6.4 | IC6.15 IC6.16 IC6.17 62.71,114 v62.69,114.02 | 62.81,104.74 60.72,104.74 v60.18,104.2 60.17,104.18 IC6.2 | IC7.3 IC7.2 IC7.1 101.49,64.2 101.92,64.63 v102.24,64.63 | IC8.2 86.16,55.98 v86.13,56.01 | IC8.15 IC8.16 IC8.17 v83.62,45.94 | v99.73,54.59 99.83,54.69 101.47,54.69 IC7.8 | IC8.10 76,55.96 v76.02,55.98
  Top 0.61: C25.2 47.52,102.24 IC10.15 IC10.2
  Top 0.813: v30.3,66.35 v32.54,66.35 | IC3.GND 43.13,15.51 42.33,14.7 C9.2
  Bottom 0.305: C12.2 52.16,31.01 IC4.7 IC4.2 IC4.3 | IC5.7 76.32,51.74 76.16,51.58 | 76.16,51.58 C13.2 | IC5.2 IC5.3 85.37,50.47 v85.65,50.19 | v76.02,55.98 76.02,51.72 76.16,51.58
  other vias: 27.46,58.22 26.24,58.22 25.02,58.22 23.8,58.22 22.58,58.22 21.36,58.22 20.14,58.22 20.14,59.44 21.36,59.44 21.36,60.66 20.14,60.66 20.14,61.88 21.36,61.88 22.58,59.44 23.8,59.44 25.02,59.44 26.24,59.44 27.46,59.44 27.46,60.66 26.24,60.66 25.02,60.66 23.8,60.66 22.58,60.66 22.58,61.88 23.8,61.88 25.02,61.88 26.24,61.88 25.02,63.09 23.8,63.09 22.58,63.09 21.36,63.09 23.8,64.31 25.02,64.31 26.24,64.31 26.14,63.09 36.01,32.79 36.01,34.01 36.01,35.23 36.01,36.45 37.23,32.79 38.45,32.79 39.67,32.79 39.57,36.45 37.23,37.67 38.45,37.67 36.01,37.67 39.57,37.67 39.67,34.01 20.14,63.09 20.14,64.31 21.36,64.31 22.58,64.31 34.79,37.67 33.57,37.67 32.35,37.67 31.14,37.67 34.79,38.68 33.57,38.68 32.35,38.68 31.14,38.68 40.89,32.79 40.89,34.01 40.89,35.23 40.89,36.45 30.07,43.14 20.14,65.33 21.36,65.33 22.58,65.33 23.8,65.33 25.02,65.33 26.24,65.33 27.25,65.33 28.27,65.33 29.29,65.33 20.14,66.35 21.36,66.35 22.58,66.35 23.8,66.35 25.02,66.35 26.24,66.35 27.25,66.35 28.27,66.35 29.29,66.35 28.68,60.66 28.68,59.44 28.68,58.22 29.9,58.22 29.9,59.44 29.9,60.66 29.92,38.68 29.92,37.67 28.7,37.67 25.04,37.67 37.23,36.45 37.23,34.01 38.45,34.01 36.01,31.57 36.01,30.35 37.23,31.57 38.45,31.57 39.67,31.57 40.89,31.57 37.23,30.35 38.45,30.35 39.67,30.35 40.89,30.35 42.11,30.35 42.11,31.57 42.11,32.79 36.01,38.68 37.23,38.68 38.45,38.68 39.57,38.68 40.79,38.68 40.79,37.67 42.01,37.67 42.01,38.68
  pour Top (rank 3, no thermals): 19.33,66.9 31.52,66.9 31.52,41.15 28.47,41.15 28.47,44.6 26.3,44.6 26.3,41.69 24.61,41.69 24.61,46.32 19.33,46.32 19.33,56.8
  pour Top (rank 3, no thermals): 32.54,22.05 32.54,26.52 30.71,26.52 30.71,21.84 29.21,21.84 29.21,26.55 24.61,26.52 24.61,39.6 44.53,39.6 44.53,29.97 34.37,29.97 34.37,22.06
  pour GND (rank 5): -2.01,120.8 119.91,120.8 119.91,-1.12 -2.01,-1.12
  pour GND: 31.78,67.4 33.35,67.4 33.35,65.53 31.78,65.53
  pour Bottom (rank 5): 55.7,69.6 55.7,17.98 -0.58,17.98 -0.58,69.6
GPIO1  (via drill 0.35)
  Top 0.203: J9.6 81.46,23.83 J8.6 72.11,21.27 v71.81,21.57 | v69.01,91.33 44.71,91.33 44.12,91.92 44.12,92.95 43.5,93.57 40.97,93.57 40.26,92.86 MCU.42
  Route15 0.203: v74.07,64.56 69.7,68.93 69.7,86.38 70.27,86.95 70.27,87.23 v70.25,87.25
  Bottom 0.203: v71.81,21.57 71.81,24.08 69.88,26.01 69.88,42.21 73.93,46.26 73.93,64.43 v74.07,64.56 | v70.25,87.25 70.25,90.8 69.71,91.34 69.02,91.34 v69.01,91.33
GPIO2  (via drill 0.35)
  Top 0.203: J8.7 70.89,23.81 70.77,23.94 v70.74,23.94 | v68.1,90.63 68.02,90.72 43.75,90.72 43.12,91.35 38.39,91.35 37.72,92.02 MCU.43
  Route15 0.203: v73.22,63.74 73.22,64.39 69.25,68.36 v69.25,87.28
  Bottom 0.203: v69.25,87.28 69.25,90.2 68.77,90.67 68.13,90.67 v68.1,90.63 | v70.74,23.94 70.54,23.94 69.47,25.01 69.47,42.44 73.45,46.42 73.45,63.51 v73.22,63.74
IMU_RST  (via drill 0.35)
  Top 0.203: IC7.12 108.87,58.52 v108.86,58.53
  Route15 0.203: v109.56,67.38 109.56,67.36 109.58,67.34 113.79,67.34 114.33,66.81 U$10.RST
  Bottom 0.203: v108.86,58.53 108.65,58.74 108.65,63.73 109.56,64.64 v109.56,67.38 109.56,76 108.36,77.21 J19.2
KANTE_L  (via drill 0.35)
  Top 0.203: MCU.29 73.28,93.97 73.83,94.52 84.23,94.52 v84.24,94.53
  Route15 0.203: v84.24,94.53 84.97,94.53 87.4,96.96 87.4,100.02 88.1,100.72 R11.1
  Bottom 0.203: X2.P$7 98.98,92.97 99.56,93.54 99.56,98.92 98.8,99.67 89.03,99.67 88.1,100.6 R11.1
KANTE_R  (via drill 0.35)
  Top 0.203: v91.27,87.2 88.4,87.2 85.05,90.55 76.56,90.55 75.82,91.29 MCU.28
  Bottom 0.203: v91.27,87.2 91.53,87.2 92.13,86.61 94.37,86.61 95.12,85.85 95.12,78.5 97.01,76.61 97.01,66.45 95.34,64.78 95.34,56.75 96.52,55.58 96.52,44.2 | X3.P$7 97.43,39.63 96.52,40.54 96.52,44.2 | R12.2 95.75,44.96 96.52,44.2
KEEPOUT
  cutout Bottom (rank 6): 48.39,29.97 48.39,17.58 35.79,17.58 35.79,29.97
  cutout Bottom (rank 6): 48.39,29.97 48.39,17.58 35.79,17.58 35.79,29.97
  cutout Route15 (rank 6): 54.28,53.34 54.28,40.13 45.59,40.13 45.59,29.97 33.49,29.97 33.49,53.34
  cutout GND (rank 6): 48.39,29.97 48.39,17.58 35.79,17.58 35.79,29.97
  cutout Route15 (rank 6): 48.39,29.97 48.39,17.58 35.79,17.58 35.79,29.97
  cutout GND (rank 6): 54.21,53.34 54.21,40.95 33.49,40.95 33.49,53.34
  cutout Bottom (rank 6): 54.32,53.35 54.32,40.96 33.48,40.96 33.48,53.35
  cutout Route15 (rank 6): 26,93.43 26,91.4 24.03,91.4 24.03,93.43
LINE_IN_L
  Bottom 0.203: R41.1 39.51,100.93 38.7,100.12 33.42,100.12 32.11,98.81 J22.2
LINE_IN_R  (via drill 0.35)
  Top 0.203: v44.31,104.72 44.3,104.73 36.17,104.73 32.78,101.34 J22.3
  Bottom 0.203: v44.31,104.72 44.32,104.73 54.74,104.73 55.51,103.96 55.51,97.81 56.93,96.39 R42.1
LINIE_L  (via drill 0.35)
  Top 0.203: v53.87,79.55 46.09,79.55 45.44,78.91 R15.1 45.43,78.37 24.69,78.37 v24.66,78.34 | X4.P$4 11.21,62.99 v16.54,62.99
  Bottom 0.203: v53.87,79.55 54,79.55 54.28,79.83 54.28,84.02 55.5,85.24 MCU.36 | v16.54,62.99 16.54,63.02 16.7,63.17 16.7,77.83 17.24,78.37 24.63,78.37 v24.66,78.34
LINIE_R  (via drill 0.35)
  Top 0.203: R14.1 v58.49,78.38 57.51,77.39 24.81,77.39 v24.67,77.25 | v17.38,66.05 17.12,65.79 X4.P$5
  Bottom 0.203: v58.49,78.38 58.36,78.38 58.04,78.69 MCU.35 | v24.67,77.25 18.02,77.25 17.39,76.61 v17.39,66.05 v17.38,66.05
MCTRL_RESET  (via drill 0.35)
  Top 0.203: IC7.11 108.96,57.25 108.94,57.28 104.58,57.28 103.92,56.63 100.17,56.63 99.36,57.43 93.31,57.43 92.77,57.97 C11.1 | v92.28,64.11 90.86,64.11 90.4,63.65 X5.P$7
  Bottom 0.203: R18.2 93.07,57.64 92.74,57.97 C11.1 91.98,58.41 91.98,63.9 92.19,64.11 v92.28,64.11
N$1
  Bottom 0.254: R16.1 18.57,55.64 13.42,60.79 X4.P$3
N$2
  Bottom 0.305: R9.1 53.3,16.23 52.22,15.15 52.22,8.28 53.03,7.47 LED3.A
N$4
  Top 0.203: R2.1 R1.2
  Bottom 0.203: D2.C D1.A R3.2 R1.2
N$5
  Bottom 0.203: R18.1 93.07,49.05 92.28,48.26 92.28,40.34 91.69,39.75 S1.3
N$6  (via drill 0.35)
  Top 0.254: v65.22,103.95 65.25,103.92 IC6.6 | v80.03,102.72 v80.03,102.71 73.68,102.71 72.97,103.41 72.97,105.85 72.2,106.62 65.81,106.62
  Top 0.305: 65.81,106.62 v65.8,106.64
  Bottom 0.254: v65.8,106.64 65.59,106.64 65.22,106.27 v65.22,103.95 | v80.03,102.72 v80.03,102.71 80.05,102.71 83.53,99.23 95.97,99.23 96.95,98.25 96.95,92.56 97.76,91.75 108.74,91.75 110.04,90.44 110.04,86.46 114.22,82.28 114.22,80.57 115.24,79.55 115.24,74.22 116.89,72.57 116.89,47.44 110.36,40.91 110.36,31.94 107.99,29.57 LED12.K
N$7
  Top 0.254: LED11.K 106.12,90.53 105.35,91.3 105.35,95.72 101.37,99.7 80.66,99.7 80.02,100.34 68.54,100.34 68.08,99.87 67.08,99.87 66.52,100.44 IC6.7
N$8
  Bottom 0.305: R7.2 37.21,8.64 38.38,7.47 LED1.A
N$9  (via drill 0.33)
  Top 0.203: C4.2 32.24,52.63 31.95,52.92 R5.1 33.57,55.15 R6.2 | IC1.4 27.19,43.13 v27.19,41.19
  Route15 0.203: v27.19,41.19 27.19,51.78 28.06,52.65 32.47,52.65 C4.2
N$11
  Bottom 0.305: R8.1 39.65,9.88 40.69,8.84 47.52,8.84 48.34,8.02 LED2.A
N$13  (via drill 0.35)
  Top 0.305: IC6.8 v67.79,100.84 v67.78,100.84
  Bottom 0.305: LED10.K 68.66,117.3 67.88,116.52 67.88,104.57 67.89,104.56 67.89,100.94 v67.78,100.84
N$14
  Top 0.203: S2.3 107.29,37.54 106.8,37.05 R28.1
N$15  (via drill 0.35)
  Top 0.305: v67.15,103.93 68.9,103.93 69.06,103.77 IC6.9
  Bottom 0.305: LED9.K 64.85,116.8 66.99,114.65 66.99,104.09 v67.15,103.93
N$16  (via drill 0.35)
  Top 0.305: IC6.11 v70.33,114.18
  Bottom 0.305: LED8.K 60.48,118.23 61.04,118.79 65.31,118.79 65.79,118.31 69.53,118.31 70.33,117.52 v70.33,114.18
N$17  (via drill 0.35)
  Top 0.305: IC6.12 69.06,110.79 68.41,110.14 v61.37,110.14
  Bottom 0.305: v61.37,110.14 61.24,110.14 61.01,110.38 61.01,114.43 60.46,114.98 56.9,114.98 56.2,115.69 56.2,117.64 LED7.K
N$18  (via drill 0.35)
  Top 0.305: IC6.13 67.76,112.49 67.76,113.57 67.45,113.88 65.8,113.88 v65.63,114.05 | v61.24,115.47 52.95,115.47 52.15,116.27 LED6.K
  Bottom 0.305: v65.63,114.05 64.21,115.47 v61.24,115.47
N$19
  Top 0.305: LED5.K 48.97,116.33 53.03,112.27 56.83,112.27 58.23,110.88 66.25,110.88 66.52,111.14 IC6.14
N$20
  Bottom 0.305: LED5.A 45.54,113.4 R29.2
N$21
  Bottom 0.305: LED6.A 49.61,116.32 47.41,114.13 R30.2
N$22
  Bottom 0.305: LED7.A 53.67,115.21 52.82,114.36 R31.2
N$23
  Top 0.305: LED8.A 57.94,118.29 58.55,118.9 65.36,118.9 65.95,118.31 71.04,118.31 71.88,117.48 R32.2
N$24
  Top 0.305: LED9.A 62.31,116.04 63.1,115.24 76.99,115.24 R33.2
N$25
  Top 0.305: R34.2 73.56,116.31 72.99,115.75 67.32,115.75 66.57,116.49 LED10.A
N$26
  Bottom 0.254: R35.2 LED11.A
N$27
  Top 0.254: R36.2 LED12.A
N$28
  Bottom 0.254: LED4.A 14.86,98.36 19.93,103.43 R27.1
N$29
  Bottom 0.254: LED4.K 17.4,94.61 17.5,94.5 U4.D
N$30
  Bottom 0.254: R17.1 16.88,56.42 15.01,58.29 X4.P$2
N$31  (via drill 0.35)
  Top 0.61: IC10.1 36.97,103.51 v36.91,103.57
  Bottom 0.61: J21.2 35.99,111.46 37.22,110.23 37.22,103.88 v36.91,103.57
N$32  (via drill 0.35)
  Top 0.61: IC10.3 36.87,100.97 36,101.83 v36,102.45
  Bottom 0.61: v36,102.45 36.02,102.47 36.02,108.84 33.41,111.46 J21.1
N$33
  Top 0.203: IC10.8 42.71,94.62 43.34,95.25 48,95.25 48,95.23 C24.1
N$38
  Bottom 0.203: R4.1 18.07,60.55 18.07,68.98 18.41,69.32 U1.1 | R4.1
N$39
  Bottom 0.203: C22.2 51.54,99.06 54.21,96.39 R42.2
N$40
  Top 0.203: IC10.7 35.6,95.89 R43.1
N$41
  Bottom 0.203: R43.2 32.76,96.19 32.76,97.86 33.52,98.62 C21.1
N$42
  Bottom 0.203: C21.2 37.17,101.16 37.91,101.9 37.91,108.94 38.62,109.65 R41.2
N$43  (via drill 0.35)
  Top 0.61: v42.31,100.97 IC10.14
  Bottom 0.61: v42.31,100.97 41.75,100.97 40.99,101.72 40.99,112.8 41.98,113.78 J20.1
N$44  (via drill 0.35)
  Top 0.61: v42.56,103.5 IC10.16
  Bottom 0.61: v42.56,103.5 42.38,103.5 41.82,104.06 41.82,110.42 42.64,111.24 J20.2
N$46
  Top 0.203: IC10.10 46.43,95.89 46.76,96.22 48.47,96.22 50.17,97.92 55.5,97.92 55.52,97.92 56.15,97.92 56.91,98.67 R44.1
N$48
  Top 0.203: C22.1 55.89,100.64 56.91,101.66 R44.2
N$51
  Top 0.203: X2.P$6 98.25,89.62 96.68,88.05 R10.1
N$53
  Bottom 0.203: R13.2 94.11,37.88 94.9,37.09 X3.P$6
RESET  (via drill 0.35)
  Top 0.203: v95.61,45.96 100.8,45.96 104.06,42.7 C15.1 | v94.31,65.74 93.9,66.14 89.16,66.14 88.42,66.89 88.42,68.26 87.69,68.99 60.17,68.99 59.44,69.71 v59.44,69.94
  Bottom 0.203: MCU.34 60.26,92.41 59.44,91.58 v59.44,69.94 | R28.2 104.05,41.87 C15.1 | v95.61,45.96 95.33,46.25 95.33,55.81 94.65,56.48 94.65,65.39 v94.31,65.74
RX1  (via drill 0.35)
  Top 0.203: v87.57,37.7 87.57,37.55 87,36.98 76.71,36.98 76.02,37.66 J12.4
  Bottom 0.203: MCU.26 80.9,91.25 82.38,89.76 82.38,70.75 83.74,69.39 83.74,63.96 84.82,62.89 X5.P$5 86.12,62.89 87.14,63.91 88.37,63.91 88.82,63.45 88.82,52.53 87.6,51.31 87.6,37.73 v87.57,37.7
RX2
  Bottom 0.203: MCU.22 78.77,72.09 81.51,69.34 81.51,63.41 80.99,62.89 X5.P$3
SCHRANKE_SHDN  (via drill 0.35)
  Top 0.203: IC7.5 100.17,58.52 99.54,57.89 96.43,57.89 93.38,60.94 v89.68,60.94
  Bottom 0.203: D6.2 91.41,77.14 88.32,74.05 88.32,64.87 89.41,63.78 89.41,61.21 v89.68,60.94
SCL1  (via drill 0.33, 0.35)
  Top 0.203: v42.84,90.67 42.84,90.4 43.25,90 v64.67,90 64.75,89.92 69,89.92 69.69,90.61 69.69,95.33 70.38,96.01 U2.S 83.22,96.01 83.7,95.53 v83.66,95.49
  Bottom 0.203: MCU.41 42.83,92.41 42.83,90.69 v42.84,90.67 | R22.1 63.9,80.9 64.25,81.24 64.25,89.67 64.57,90 v64.67,90 | v83.66,95.49 83.66,97.76 J4.4
SCL1_5V  (via drill 0.35)
  Top 0.203: IC6.18 61.39,112.5 61.39,114.11 62.02,114.74 68.56,114.74 v69.08,114.22 | v75.35,33.75 75.37,33.72 96.11,33.72 96.95,32.88 96.95,30.15 97.52,29.59 X3.P$3 | IC8.18 84.89,42.88 84.34,42.33 v74.97,42.33 | IC7.14 103.66,61.06 v103.25,60.66 | R24.1 94.62,96.65 92,99.26 80.73,99.26 79.47,98.01 74.95,98.01 73.36,99.6 v68.88,99.6
  Bottom 0.203: v69.08,114.22 69.45,113.84 69.45,100.17 v68.88,99.6 68.05,98.77 U2.D | 101.43,60.25 101.43,40.42 100.84,39.83 100.84,30.4 100.02,29.59 X3.P$3 | v75.35,33.75 75.35,33.71 75.32,33.71 75.31,33.72 75.28,33.7 75.26,33.67 75.25,33.68 | 75.25,33.68 74.84,33.27 74.84,28.72 75.52,28.04 J3.4 | v74.97,42.33 74.8,42.17 74.8,34.13 75.25,33.68 | v103.25,60.66 101.84,60.66 101.43,60.25 | 101.43,60.25 101.43,81.68 100.18,82.93 X2.P$3 97.38,82.93 96.33,83.98 96.33,93.59 94.62,95.31 R24.1
SCL2  (via drill 0.35)
  Top 0.203: R26.1 45.44,83.11 46.08,82.47 86.11,82.47 87.2,81.38 97.85,81.38 97.85,81.39 100.81,81.39 101.35,80.85 112.84,80.85 113.32,80.37 v113.32,80.16 | J10.3 73.48,31.08 74.18,30.38 77.04,30.38 78.66,32 94.64,32 95.24,31.41 v95.24,31.14
  Bottom 0.203: MCU.39 47.87,92.39 47.87,83.83 47.47,83.44 R26.1 | v113.32,80.16 113.32,77.49 111.22,75.39 111.22,61.9 | v95.24,31.14 95.24,31.07 97.7,28.62 100,28.62 105.51,34.13 105.51,43.92 111.22,49.62 111.22,61.9 | U$10.SCL 111.8,61.32 111.22,61.9
SCL3  (via drill 0.35)
  Top 0.203: J11.3 73.48,35.74 72.87,36.36 66.51,36.36 v66.17,36.7
  Bottom 0.203: v66.17,36.7 66.19,36.72 66.19,39 68.48,41.29 68.48,42.92 72.6,47.04 72.6,61.84 71.96,62.48 71.96,65.53 69.05,68.44 38.38,68.44 37.72,69.11 MCU.6
SDA1  (via drill 0.33, 0.35)
  Top 0.203: 53.87,89.57 45.6,89.57 v45.32,89.29 | R21.1 53.87,88.38 53.87,89.57 | v62.92,89.21 62.02,89.21 61.66,89.57 53.87,89.57 | J4.3 86.22,98.11 85.48,98.86 81.33,98.86 79.9,97.44 74.46,97.44 72.97,98.92 64.88,98.92 64.24,98.28 64.24,96.04 U3.S
  Bottom 0.203: v45.32,89.29 45.32,92.39 MCU.40 | v62.92,89.21 62.38,89.21 61.77,89.82 61.77,94.46 63.32,96.01 U3.S
SDA1_5V  (via drill 0.35)
  Top 0.203: v60.15,114.03 60.17,114.01 IC6.19 | v72.89,33.05 72.91,33.03 95.78,33.03 95.79,33.02 v95.8,33.02 96.06,33.02 96.52,32.56 96.52,27.84 97.27,27.09 X3.P$2 | IC8.19 86.16,42.34 85.46,41.64 72.94,41.64 v72.91,41.61 | IC7.15 104.6,62.33 103.66,63.28 103.66,64.92 102.84,65.74 v100.2,65.74 | R23.1 94.62,94.08 92.18,96.52 72.28,96.52 71.63,97.17 70.09,97.17 69.28,96.35 69.28,95.5 68.56,94.78 62.47,94.78 61.72,95.53 U3.D
  Bottom 0.203: v60.15,114.03 60.17,114.01 60.17,109.63 61.73,108.07 U3.D | J3.3 73.06,28.04 72.41,28.7 72.41,32.62 72.84,33.05 v72.89,33.05 72.81,33.05 72.36,33.49 72.36,41.25 72.72,41.61 v72.91,41.61 | v100.2,65.74 100.46,65.74 100.89,66.17 | 100.89,66.17 100.89,79.41 99.87,80.43 X2.P$2 97.03,80.43 95.88,81.58 95.88,93.02 95.22,93.68 R23.1 | v95.8,33.02 95.83,33.05 99.41,33.05 100.2,33.83 100.2,39.93 100.89,40.62 100.89,66.17
SDA2  (via drill 0.33, 0.35)
  Top 0.203: v50.41,85.79 50.68,86.06 62.9,86.06 63.17,85.79 v63.17,85.55 | v114.05,79.43 114.05,80.58 113.38,81.25 101.55,81.25 101.01,81.79 97.68,81.79 87.77,81.79 86.12,83.44 R25.1 | J10.4 76.02,31.9 76.53,32.41 95.32,32.41 96.04,31.7 96.04,30.91 95.23,30.1 v95.23,29.87
  Bottom 0.203: v50.41,85.79 v50.42,85.8 MCU.38 | R25.1 v63.17,85.55 | v63.17,85.55 | v114.05,79.43 v114.04,79.42 114.04,77.4 111.8,75.16 111.8,64.7 112.71,63.79 114.26,63.79 U$10.SDA 114.61,63.86 115.23,63.23 115.23,52.96 105.92,43.65 105.92,33.86 100.27,28.21 96.25,28.21 95.23,29.23 v95.23,29.87
SDA3  (via drill 0.35)
  Top 0.203: J11.4 75.41,35.15 74.06,33.81 v67.2,33.81 v67.19,33.81
  Bottom 0.203: v67.19,33.81 67.06,33.94 67.06,39.3 68.91,41.15 68.91,42.57 73.01,46.67 73.01,62.01 72.46,62.56 72.46,65.64 69.25,68.85 41,68.85 40.26,69.59 MCU.7
SERVO1_FB
  Bottom 0.203: MCU.16 63.12,71.04 63.75,70.41 72.2,70.41 72.79,69.82 J6.4
SERVO1_PWM
  Bottom 0.203: R37.1 43.64,80.9 42.8,80.06 MCU.8 42.8,69.9 43.44,69.26 69.45,69.26 72.57,66.14 74.52,66.14 75.33,66.95 J6.3
SERVO2_FB  (via drill 0.33)
  Top 0.203: J13.4 66.59,77.78 66.39,77.58 v66.39,77.56
  Bottom 0.203: v66.39,77.56 66.19,77.36 66.19,72.4 65.88,72.09 MCU.17
SERVO2_PWM  (via drill 0.33)
  Top 0.203: J13.3 65.52,80.32 v65.5,80.3 | v64.85,76.1 55.09,76.1 53.85,74.85 46.1,74.85 45.44,75.51 R38.1
  Bottom 0.203: v65.5,80.3 65.25,80.05 65.25,76.34 65.01,76.1 v64.85,76.1 | MCU.9 45.34,75.72 R38.1
SERVO3_FB
  Top 0.203: MCU.5 35.18,69.34 35.94,68.58 69.72,68.58 72.77,65.53 86.56,65.53 87.25,66.22 J14.4
SERVO3_PWM
  Top 0.203: MCU.18 68.2,70.3 68.94,69.56 89.33,69.56 89.79,69.1 J14.3
  Bottom 0.203: MCU.18 68.15,72.14 R39.1
SERVO4_PWM
  Top 0.203: MCU.19 70.74,70.67 71.35,70.06 89.35,70.06 89.81,70.53 J15.3
  Bottom 0.203: MCU.19 70.74,78.74 70.13,79.35 R40.1
SPI1_CS1
  Top 0.203: MCU.12 52.96,72.59 53.57,73.2 60.77,73.2 64.06,73.2 64.87,74.01 106.98,74.01 113.4,67.59 113.4,50.26 110.57,47.43 110.57,37.96 107.2,34.59 102.57,34.59 100.15,32.16 100.15,23.38 99.48,22.71 83.09,22.71 82.74,22.35 81.61,22.35 80.78,21.52 80.78,20.71 79.87,19.8 78.44,19.8 73.99,15.34 71.46,15.34 70.69,14.57 J7.6
SPI1_CS2
  Top 0.203: MCU.11 50.42,71.61 51,71.03 63.54,71.03 64.18,71.68 64.18,72.69 65.05,73.56 106.79,73.56 112.98,67.36 112.98,50.44 110.17,47.62 110.17,38.13 107.03,34.99 102.38,34.99 99.74,32.35 99.74,23.54 99.32,23.13 82.94,23.13 82.57,22.76 81.41,22.76 80.29,21.64 80.29,20.86 79.63,20.2 78.1,20.2 74.77,16.87 J7.7
SPI1_CS3  (via drill 0.35)
  Top 0.203: MCU.10 47.88,71.32 48.57,70.63 63.73,70.63 64.6,71.5 64.6,72.52 65.22,73.14 106.58,73.14 112.54,67.18 112.54,50.61 109.76,47.83 109.76,38.3 106.86,35.4 102.19,35.4 99.33,32.55 99.33,23.89 98.98,23.54 84.37,23.54 83.02,24.89 v72.84,24.89
  Bottom 0.203: v72.84,24.89 72.55,24.61 72.55,20.57 71.96,19.98 71.96,17.55 71.27,16.87 J7.8
SPI1_MISO  (via drill 0.33)
  Top 0.203: v58.03,74.54 58.03,74.6 58.33,74.9 107.29,74.9 113.37,68.83 114.71,68.83 116.93,66.61 116.93,47.84 115.07,45.98 112.72,45.98 111.39,44.64 111.39,37.62 111.22,37.46 111.22,37.45 107.4,33.63 102.88,33.63 100.98,31.73 100.98,23.03 99.77,21.82 85.2,21.82 J9.4 82.11,18.73 81.45,18.73 J8.4 75.82,13.11 71.43,13.11 70.69,12.37 J7.4
  Bottom 0.203: v58.03,74.54 MCU.14
SPI1_MOSI  (via drill 0.35)
  Top 0.203: v55.5,74.87 55.5,75.04 55.77,75.31 107.48,75.31 113.55,69.23 114.88,69.23 117.44,66.68 117.44,47.77 115.24,45.57 112.89,45.57 111.79,44.47 111.79,37.45 107.5,33.15 107.5,33.14 103,33.14 101.4,31.54 101.4,22.87 99.95,21.42 87.38,21.42 82.17,16.21 J9.3 81.46,16.21 J8.3 78.9,13.63 77.97,12.7 73.82,12.7 73.23,12.1 J7.3
  Bottom 0.203: v55.5,74.87 MCU.13
SPI1_SCK  (via drill 0.33)
  Top 0.203: v60.58,74.11 60.58,74.22 60.83,74.47 107.12,74.47 113.17,68.42 114.54,68.42 116.53,66.44 116.53,48.01 114.9,46.38 112.56,46.38 112.31,46.13 112.29,46.13 110.98,44.82 110.98,37.79 107.27,34.08 102.67,34.08 100.55,31.96 100.55,23.21 99.64,22.29 83.25,22.29 82.24,21.29 J9.5 79.57,18.73 J8.5 74.5,14.33 J7.5
  Bottom 0.203: v60.58,74.11 | v60.58,74.11 MCU.15
SPI2_CS1  (via drill 0.35)
  Top 0.203: J16.4 78.34,107.16 77.7,107.8 v64.22,107.8
  Bottom 0.203: MCU.33 63.77,92.41 65.29,93.92 65.29,102.32 64.42,103.19 64.42,107.6 v64.22,107.8
SPI2_MISO
  Bottom 0.203: MCU.31 69.11,92.41 70.87,94.17 76.31,94.17 77.24,95.1 77.24,101 77.84,101.6 J16.8
SPI2_MOSI
  Bottom 0.203: J16.6 78.34,103.62 77.64,102.92 74.74,102.92 73.79,101.96 73.79,101.91 73.86,101.84 73.86,97.98 73.88,97.95 73.88,95.7 72.97,94.79 68.86,94.79 66.47,92.41 MCU.32
SPI2_SCK
  Bottom 0.203: J16.10 78.34,94.59 77.37,93.63 72.77,93.63 71.55,92.41 MCU.30
TX1  (via drill 0.35)
  Top 0.203: v86.75,39.28 86.76,39.27 86.76,39.12 86.08,38.45 81.23,38.45 79.94,39.73 74.27,39.73 73.48,38.95 J12.3
  Bottom 0.203: MCU.27 78.36,91.32 81.98,87.7 81.98,70.46 83.23,69.2 83.23,63.88 84.07,63.04 84.07,62.55 84.81,61.81 87.29,61.81 87.86,62.37 X5.P$6 87.86,62.45 88.25,62.06 88.25,52.96 86.75,51.46 v86.75,39.28
TX2
  Bottom 0.203: MCU.23 80.9,70.66 82.02,69.55 82.02,63.39 82.51,62.89 X5.P$4
V5_L2
  Top 1.524: D4.C 29.69,19.41 28.25,20.85 IC2.2 | IC2.2 28.25,24.05 28.27,24.08 28.27,23.48 IC2.2
  Route15 1.524: D4.C 41.28,19.41 L2.1
V5_L3  (via drill 0.35)
  Top 0.305: IC2.4 31.65,21.6 v31.63,21.59
  Route15 0.305: v31.63,21.59 31.63,28.57 32.57,29.5 43.77,29.5
  Route15 1.524: L2.2 43.77,28.89 43.77,29.5 43.77,34.56 C7.+ 43.82,35.91 43.82,41.63 47.63,45.44 L3.1
V6_L1
  Top 1.524: D3.C 25.08,39.41 23.74,40.75 23.74,43.71 23.77,43.67 IC1.2
  Route15 1.524: D3.C 28.66,39.4 29.55,40.28 36.43,40.28 L1.1
VL53L0X_SHUT_L
  Top 0.203: D5.1 96.61,82.91 98.25,84.55 X2.P$4
VL53L0X_SHUT_R
  Bottom 0.203: X3.P$4 95.41,32.09 92.8,34.7 D7.1
VL6180X_SHDN
  Top 0.203: D6.1 91.41,85.89 92.18,86.67 97.39,86.67 98.25,87.52 X2.P$5

## Text on the board
tPlace: Servo 2 | JLCJLCJLCJLC | Servo 4 | Servo 1 | Servo 3 | BPS-SENSOR
tNames: RPi-Interface | Audio | I2C1 | GND | +3V3 | max. +18V | _ | + | Motorctrl | + | Reset | T | Uart 1 | BAT | I2C 3 | Reset Motor | I2C 2 | I2C 1 5V | SPI1 | 6 V | 5 V | 3.3 V | Display
bNames: ct-Bot v2 Mainboard / T. Sandmann, CC BY-SA 4.0 / v0.9.2 - 08/2022